# EAGLE schematic kreme-iss (EAGLE 9.5.1)

## Sheet 1 of 4
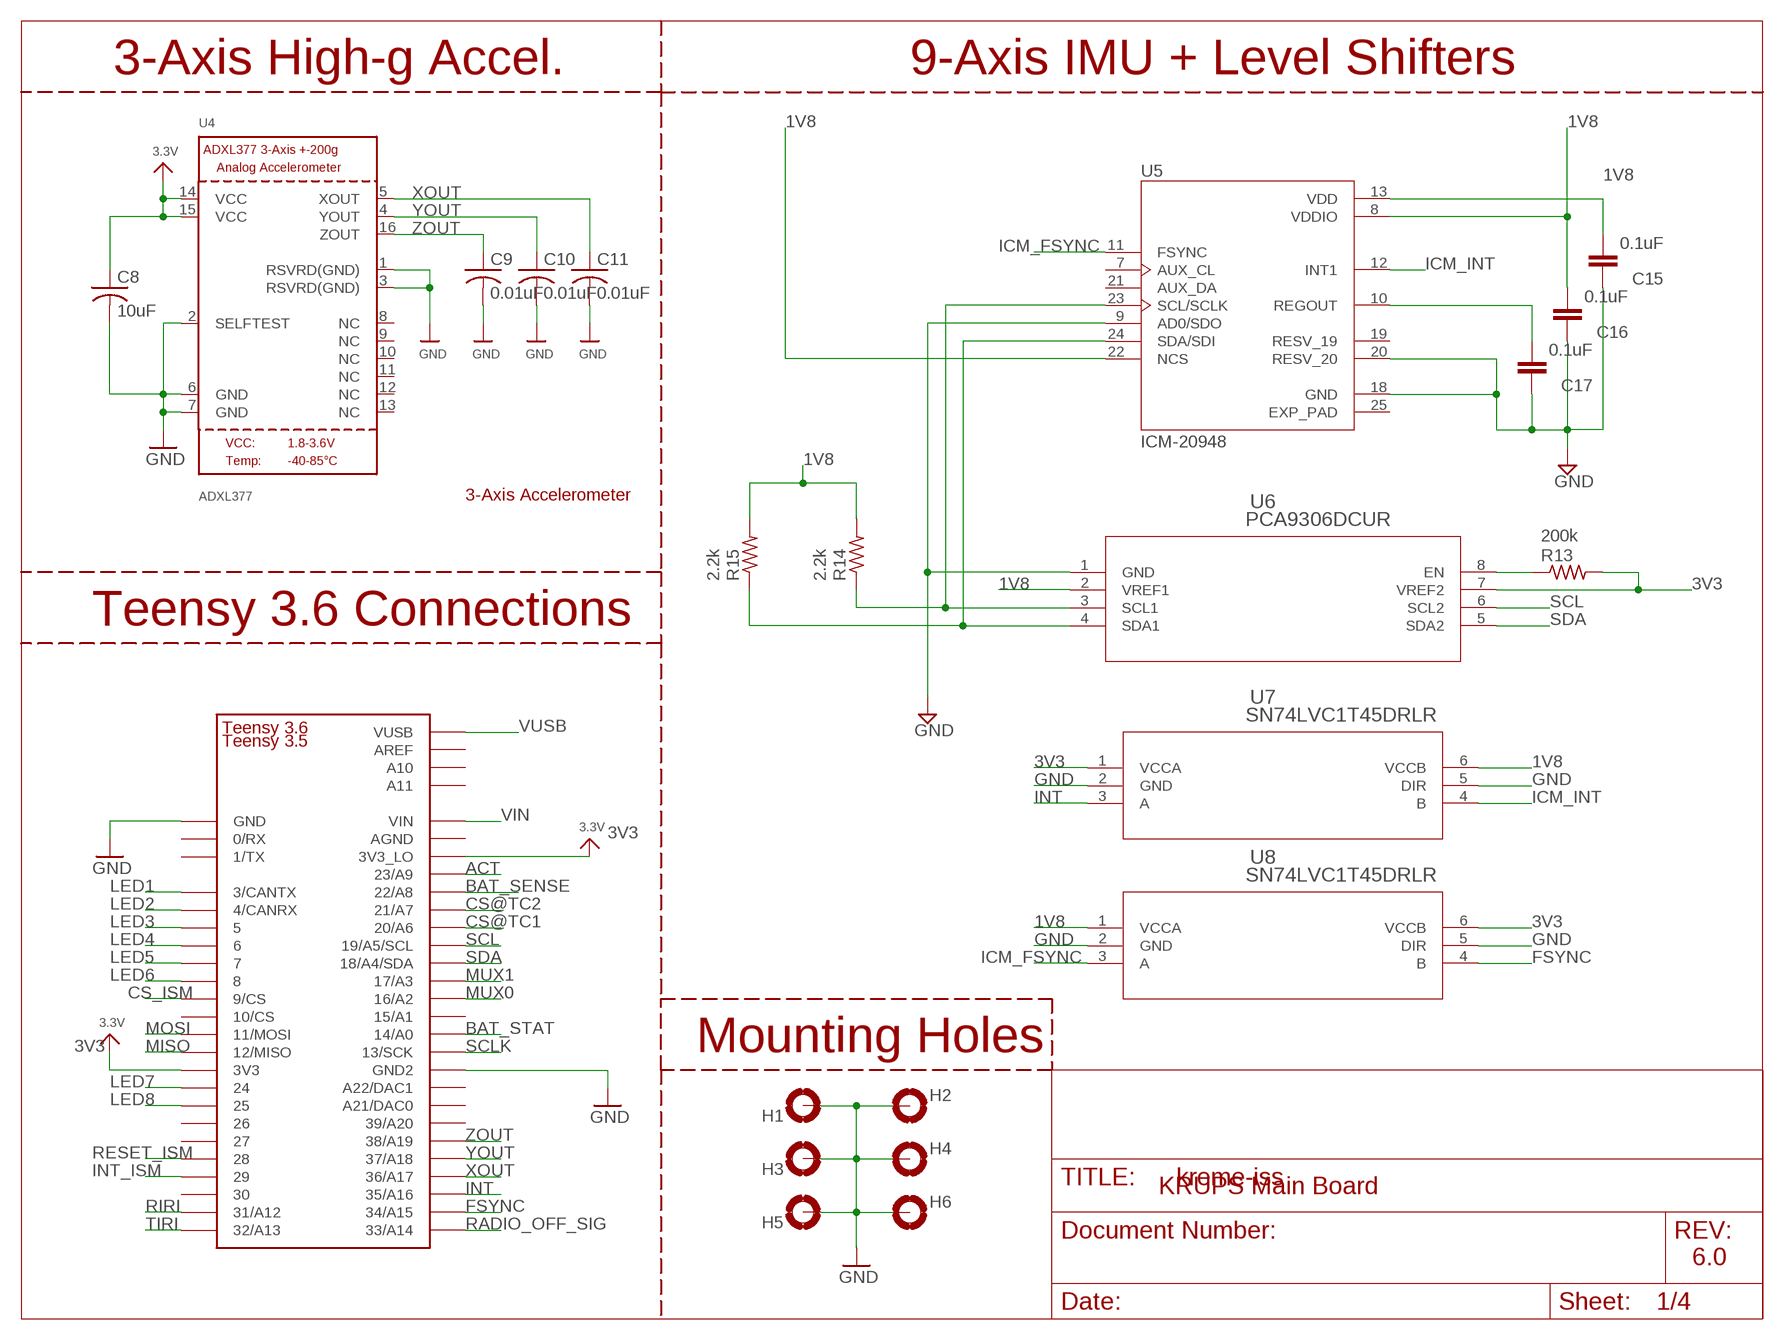
[diagram p0: schematic, sheet 1]

### Parts
C8  10uF  C-USC0603  [C0603]
C9  0.01uF  C-USC0603  [C0603]
C10  0.01uF  C-USC0603  [C0603]
C11  0.01uF  C-USC0603  [C0603]
C15  0.1uF  C-EUC0603  [C0603]
C16  0.1uF  C-EUC0603  [C0603]
C17  0.1uF  C-EUC0603  [C0603]
H1  MOUNT-PAD-ROUND2.8  [2,8-PAD]
H2  MOUNT-PAD-ROUND2.8  [2,8-PAD]
H3  MOUNT-PAD-ROUND2.8  [2,8-PAD]
H4  MOUNT-PAD-ROUND2.8  [2,8-PAD]
H5  MOUNT-PAD-ROUND2.8  [2,8-PAD]
H6  MOUNT-PAD-ROUND2.8  [2,8-PAD]
R13  200k  R-US_R0603  [R0603]
R14  2.2k  R-US_R0603  [R0603]
R15  2.2k  R-US_R0603  [R0603]
U4  ADXL377  ACCEL_ADXL377  [LFCSP16_LQ]
U5  ICM-20948  [QFN40P300X300X105-25N]
U6  PCA9306DCUR  [DCU8]
U7  SN74LVC1T45DRLR  [DRL6]
U8  SN74LVC1T45DRLR  [DRL6]
U$1  TEENSY_3.5/3.6_BASIC  [TEENSY_3.5/3.6_BASIC]

### Nets
1V8: C15.2 C16.2 R14.2 R15.2 U5.8(VDDIO) U5.13(VDD) U5.22(NCS) U6.2(VREF1) U7.6(VCCB) U8.1(VCCA) ; also sheet 3
3V3: C8.1 R13.2 U4.14(VCC) U4.15(VCC) U6.7(VREF2) U7.1(VCCA) U8.6(VCCB) U$1.3V3 U$1.3V3_LO ; supply symbol labelled 3.3V ; also sheet 2,3
ACT: U$1.23/A9 ; also sheet 3
BAT_SENSE: U$1.22/A8 ; also sheet 3
BAT_STAT: U$1.14/A0 ; also sheet 3
CS@TC1: U$1.20/A6 ; also sheet 2
CS@TC2: U$1.21/A7 ; also sheet 2
CS_ISM: U$1.9/CS ; also sheet 4
FSYNC: U8.4(B) U$1.34/A15
GND: C8.2 C9.2 C10.2 C11.2 C15.1 C16.1 C17.1 H1.B2,8(MOUNT) H2.B2,8(MOUNT) H3.B2,8(MOUNT) H4.B2,8(MOUNT) H5.B2,8(MOUNT) H6.B2,8(MOUNT) U4.1(RSVRD(GND)) U4.2(SELFTEST) U4.3(RSVRD(GND)) U4.6(GND) U4.7(GND) U5.9(AD0/SDO) U5.18(GND) U5.20(RESV_20) U6.1(GND) U7.2(GND) U7.5(DIR) U8.2(GND) U8.5(DIR) U$1.GND ; also sheet 2,3,4
ICM_FSYNC: U5.11(FSYNC) U8.3(A)
ICM_INT: U5.12(INT1) U7.4(B)
INT: U7.3(A) U$1.35/A16
INT_ISM: U$1.29 ; also sheet 4
LED1: U$1.3/CANTX ; also sheet 4
LED2: U$1.4/CANRX ; also sheet 4
LED3: U$1.5 ; also sheet 4
LED4: U$1.6 ; also sheet 4
LED5: U$1.7 ; also sheet 4
LED6: U$1.8 ; also sheet 4
LED7: U$1.24 ; also sheet 4
LED8: U$1.25 ; also sheet 4
MISO: U$1.12/MISO ; also sheet 2,4
MOSI: U$1.11/MOSI ; also sheet 4
MUX0: U$1.16/A2 ; also sheet 2
MUX1: U$1.17/A3 ; also sheet 2
N$1: U$1.GND2 ; supply symbol labelled GND
N$13: R13.1 U6.8(EN)
N$15: C17.2 U5.10(REGOUT)
N$18: R14.1 U5.23(SCL/SCLK) U6.3(SCL1)
N$19: R15.1 U5.24(SDA/SDI) U6.4(SDA1)
RADIO_OFF_SIG: U$1.33/A14 ; also sheet 3
RESET_ISM: U$1.28 ; also sheet 4
RIRI: U$1.31/A12 ; also sheet 2
SCL: U6.6(SCL2) U$1.19/A5/SCL
SCLK: U$1.13/SCK ; also sheet 2,4
SDA: U6.5(SDA2) U$1.18/A4/SDA
TIRI: U$1.32/A13 ; also sheet 2
VIN: U$1.VIN ; also sheet 3
VUSB: U$1.VUSB ; also sheet 3
XOUT: C11.1 U4.5(XOUT) U$1.36/A17
YOUT: C10.1 U4.4(YOUT) U$1.37/A18
ZOUT: C9.1 U4.16(ZOUT) U$1.38/A19
Unconnected: U4.8(NC) U4.9(NC) U4.10(NC) U4.11(NC) U4.12(NC) U4.13(NC) U5.7(AUX_CL) U5.19(RESV_19) U5.21(AUX_DA) U$1.0/RX U$1.1/TX U$1.10/CS U$1.15/A1 U$1.21/DAC0(A21/DAC0) U$1.26 U$1.27 U$1.30 U$1.39/A20 U$1.A10 U$1.A11 U$1.A22/DAC1 U$1.AGND U$1.AREF

### Notes on the sheet
- 3-Axis High-g Accel. | 9-Axis IMU + Level Shifters
- 3-Axis Accelerometer
- Teensy 3.6 Connections
- Teensy 3.5
- Mounting Holes
- KRUPS Main Board
- 6.0

## Sheet 2 of 4
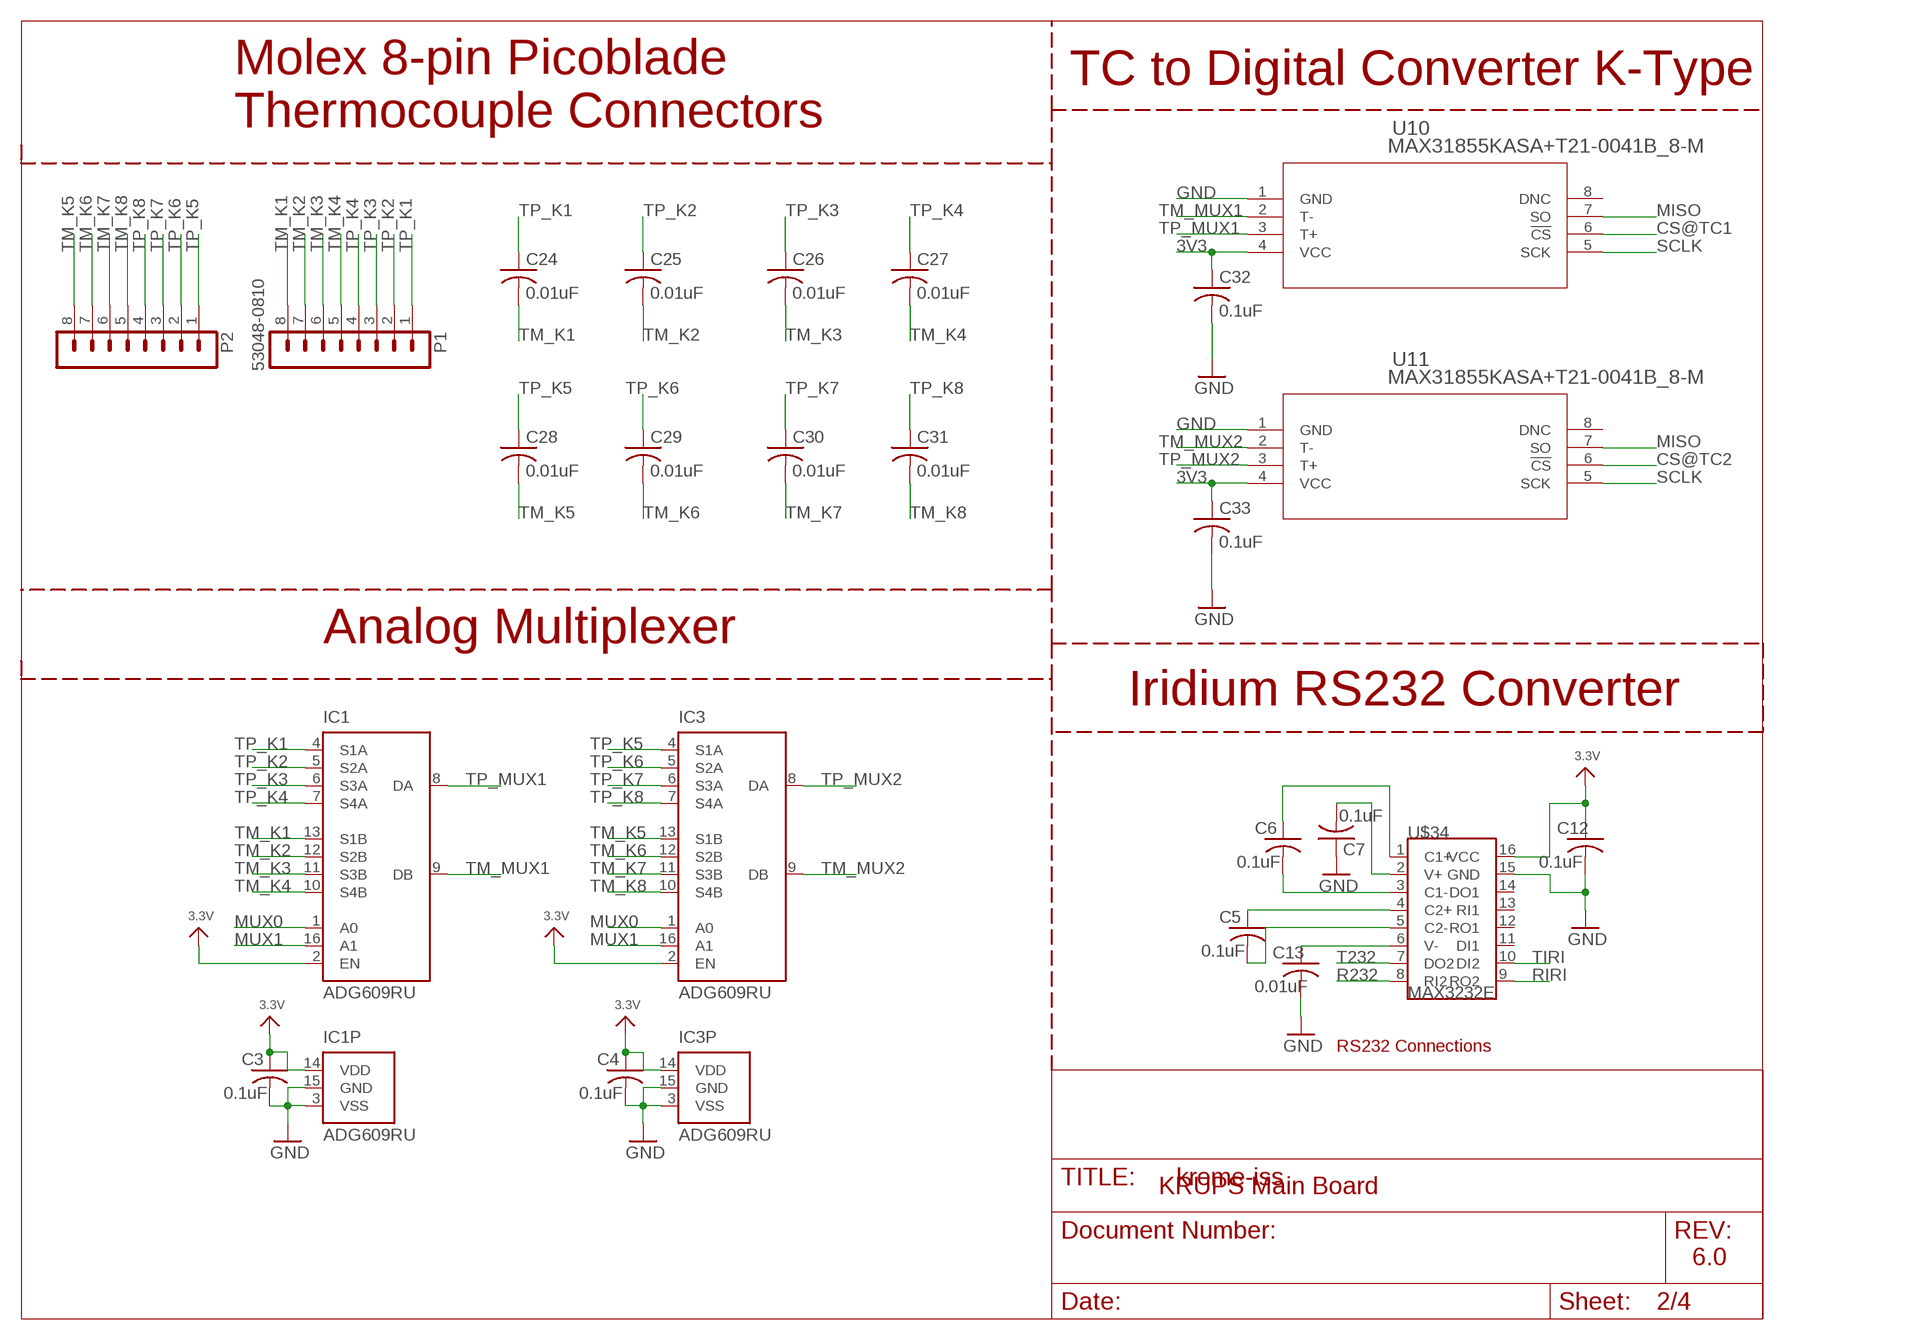
[diagram p1: schematic, sheet 2]

### Parts
C3  0.1uF  C-USC0603  [C0603]
C4  0.1uF  C-USC0603  [C0603]
C5  0.1uF  C-USC0603  [C0603]
C6  0.1uF  C-USC0603  [C0603]
C7  0.1uF  C-USC0603  [C0603]
C12  0.1uF  C-USC0603  [C0603]
C13  0.01uF  C-USC0603  [C0603]
C24  0.01uF  C-USC0603  [C0603]
C25  0.01uF  C-USC0603  [C0603]
C26  0.01uF  C-USC0603  [C0603]
C27  0.01uF  C-USC0603  [C0603]
C28  0.01uF  C-USC0603  [C0603]
C29  0.01uF  C-USC0603  [C0603]
C30  0.01uF  C-USC0603  [C0603]
C31  0.01uF  C-USC0603  [C0603]
C32  0.1uF  C-USC0603  [C0603]
C33  0.1uF  C-USC0603  [C0603]
IC1  ADG609RU  [TSSOP16]
IC3  ADG609RU  [TSSOP16]
P1  53048-0810  [53048-0810]
P2  53048-0810  [53048-0810]
U10  MAX31855KASA+T21-0041B_8-M  [21-0041B_8-M]
U11  MAX31855KASA+T21-0041B_8-M  [21-0041B_8-M]
U$34  MAX3232E  [SSOP-16]

### Nets
3V3: C3.1 C4.1 C12.1 C32.1 C33.1 IC1.2(EN) IC1.14(VDD) IC3.2(EN) IC3.14(VDD) U10.4(VCC) U11.4(VCC) U$34.16(VCC) ; supply symbol labelled 3.3V ; also sheet 1,3
CS@TC1: U10.6(!CS) ; also sheet 1
CS@TC2: U11.6(!CS) ; also sheet 1
GND: C3.2 C4.2 C7.1 C12.2 C13.2 C32.2 C33.2 IC1.3(VSS) IC1.15(GND) IC3.3(VSS) IC3.15(GND) U10.1(GND) U11.1(GND) U$34.15(GND) ; also sheet 1,3,4
MISO: U10.7(SO) U11.7(SO) ; also sheet 1,4
MUX0: IC1.1(A0) IC3.1(A0) ; also sheet 1
MUX1: IC1.16(A1) IC3.16(A1) ; also sheet 1
N$5: C5.2 U$34.5(C2-)
N$8: C6.1 U$34.1(C1+)
N$10: C6.2 U$34.3(C1-)
N$11: C5.1 U$34.4(C2+)
N$14: C13.1 U$34.6(V-)
N$17: C7.2 U$34.2(V+)
R232: U$34.8(RI2) ; also sheet 3
RIRI: U$34.9(RO2) ; also sheet 1
SCLK: U10.5(SCK) U11.5(SCK) ; also sheet 1,4
T232: U$34.7(DO2) ; also sheet 3
TIRI: U$34.10(DI2) ; also sheet 1
TM_K1: C24.2 IC1.13(S1B) P1.8
TM_K2: C25.2 IC1.12(S2B) P1.7
TM_K3: C26.2 IC1.11(S3B) P1.6
TM_K4: C27.2 IC1.10(S4B) P1.5
TM_K5: C28.2 IC3.13(S1B) P2.8
TM_K6: C29.2 IC3.12(S2B) P2.7
TM_K7: C30.2 IC3.11(S3B) P2.6
TM_K8: C31.2 IC3.10(S4B) P2.5
TM_MUX1: IC1.9(DB) U10.2(T-)
TM_MUX2: IC3.9(DB) U11.2(T-)
TP_K1: C24.1 IC1.4(S1A) P1.1
TP_K2: C25.1 IC1.5(S2A) P1.2
TP_K3: C26.1 IC1.6(S3A) P1.3
TP_K4: C27.1 IC1.7(S4A) P1.4
TP_K5: C28.1 IC3.4(S1A) P2.1
TP_K6: C29.1 IC3.5(S2A) P2.2
TP_K7: C30.1 IC3.6(S3A) P2.3
TP_K8: C31.1 IC3.7(S4A) P2.4
TP_MUX1: IC1.8(DA) U10.3(T+)
TP_MUX2: IC3.8(DA) U11.3(T+)
Unconnected: U10.8(DNC) U11.8(DNC) U$34.11(DI1) U$34.12(RO1) U$34.13(RI1) U$34.14(DO1)

### Notes on the sheet
- TC to Digital Converter K-Type
- Molex 8-pin Picoblade
  Thermocouple Connectors
- Analog Multiplexer
- Iridium RS232 Converter
- RS232 Connections
- KRUPS Main Board
- 6.0

## Sheet 3 of 4
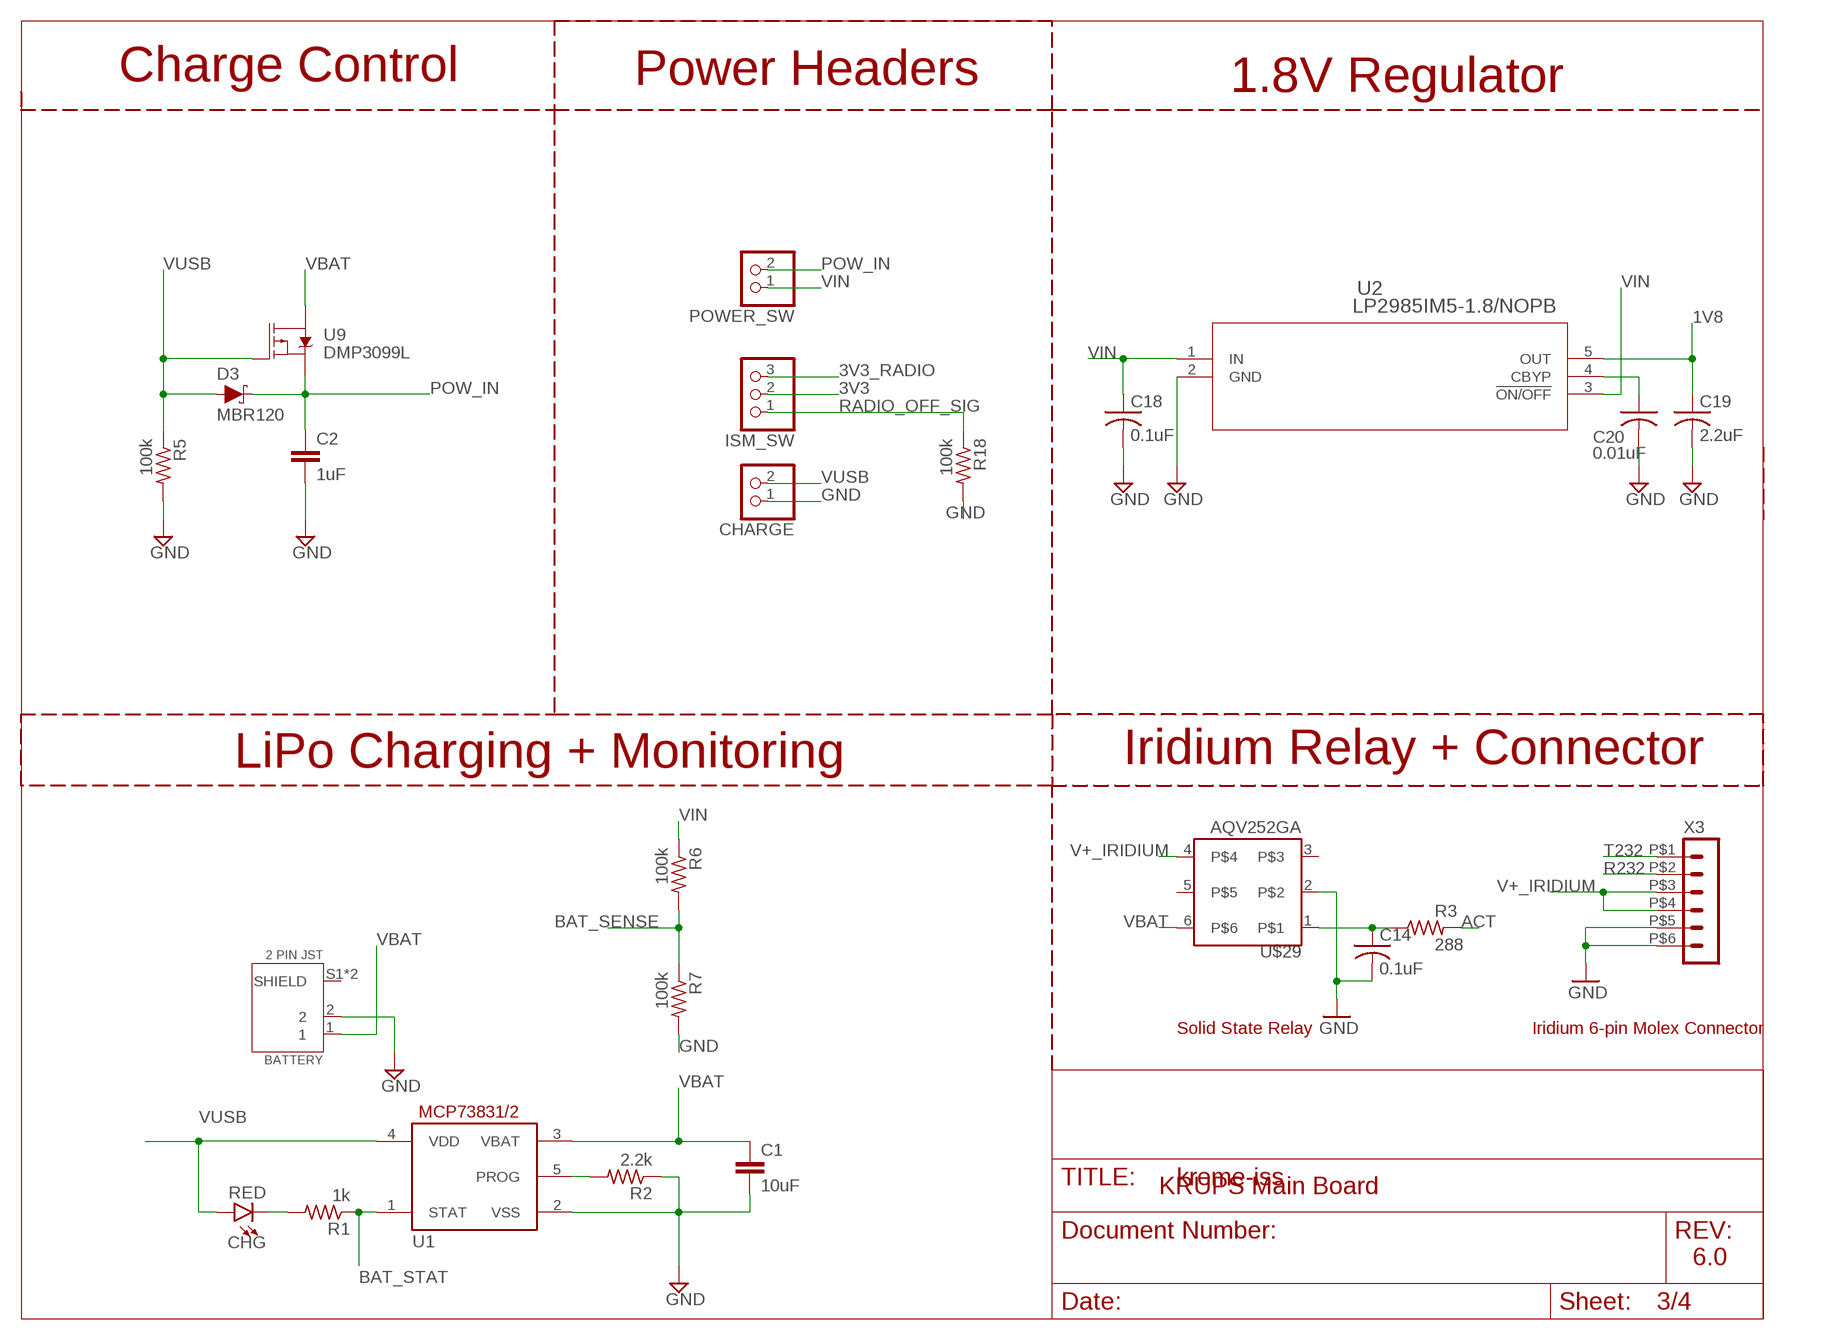
[diagram p2: schematic, sheet 3]

### Parts
BATTERY  2 PIN JST  S2B-PH-SM4-TB(LF)(SN)  [JST_S2B-PH-SM4-TB(LF)(SN)]
C1  10uF  C-EUC0603  [C0603]
C2  1uF  C-EUC0603  [C0603]
C14  0.1uF  C-USC0603  [C0603]
C18  0.1uF  C-USC0603  [C0603]
C19  2.2uF  C-USC0603  [C0603]
C20  0.01uF  C-USC0603  [C0603]
CHARGE  PINHD-1X2  [1X02]
CHG  RED  LED-RED0603  [LED-0603]
D3  MBR120  [SOD123FL]
ISM_SW  PINHD-1X3CB  [1X03-CLEANBIG]
POWER_SW  PINHD-1X2  [1X02]
R1  1k  R-US_R0603  [R0603]
R2  2.2k  R-US_R0603  [R0603]
R3  288  R-US_R0603  [R0603]
R5  100k  R-US_R0603  [R0603]
R6  100k  R-US_R0603  [R0603]
R7  100k  R-US_R0603  [R0603]
R18  100k  R-US_R0603  [R0603]
U1  MCP73831/OT  [SOT23-5L]
U2  LP2985IM5-1.8/NOPB  [MF05A]
U9  DMP3099L  [SOT23]
U$29  AQV252GA  [DIP6]
X3  HEADER_POS6_43650-0600  [43650-0600]

### Nets
1V8: C19.1 U2.5(OUT) ; also sheet 1
3V3: ISM_SW.2 ; also sheet 1,2
3V3_RADIO: ISM_SW.3 ; also sheet 4
ACT: R3.2 ; also sheet 1
BAT_SENSE: R6.2 R7.1 ; also sheet 1
BAT_STAT: R1.1 U1.1(STAT) ; also sheet 1
GND: BATTERY.2 C1.2 C2.2 C14.2 C18.2 C19.2 C20.2 CHARGE.1 R2.1 R5.2 R7.2 R18.2 U1.2(VSS) U2.2(GND) U$29.2 X3.P$5 X3.P$6 ; also sheet 1,2,4
N$4: R2.2 U1.5(PROG)
N$6: C14.1 R3.1 U$29.1
N$9: CHG.C R1.2
N$12: C20.1 U2.4(CBYP)
POW_IN: C2.1 D3.C POWER_SW.2 U9.2(S)
R232: X3.P$2 ; also sheet 2
RADIO_OFF_SIG: ISM_SW.1 R18.1 ; also sheet 1
T232: X3.P$1 ; also sheet 2
V+_IRIDIUM: U$29.4 X3.P$3 X3.P$4
VBAT: BATTERY.1 C1.1 U1.3(VBAT) U9.3(D) U$29.6
VIN: C18.1 POWER_SW.1 R6.1 U2.1(IN) U2.3(!ON/OFF) ; also sheet 1
VUSB: CHARGE.2 CHG.A D3.A R5.1 U1.4(VDD) U9.1(G) ; also sheet 1
Unconnected: BATTERY.S1(SHIELD) BATTERY.S2(SHIELD) U$29.3 U$29.5

### Notes on the sheet
- Charge Control | Power Headers | 1.8V Regulator
- LiPo Charging + Monitoring | Iridium Relay + Connector
- Solid State Relay | Iridium 6-pin Molex Connector
- KRUPS Main Board
- 6.0

## Sheet 4 of 4
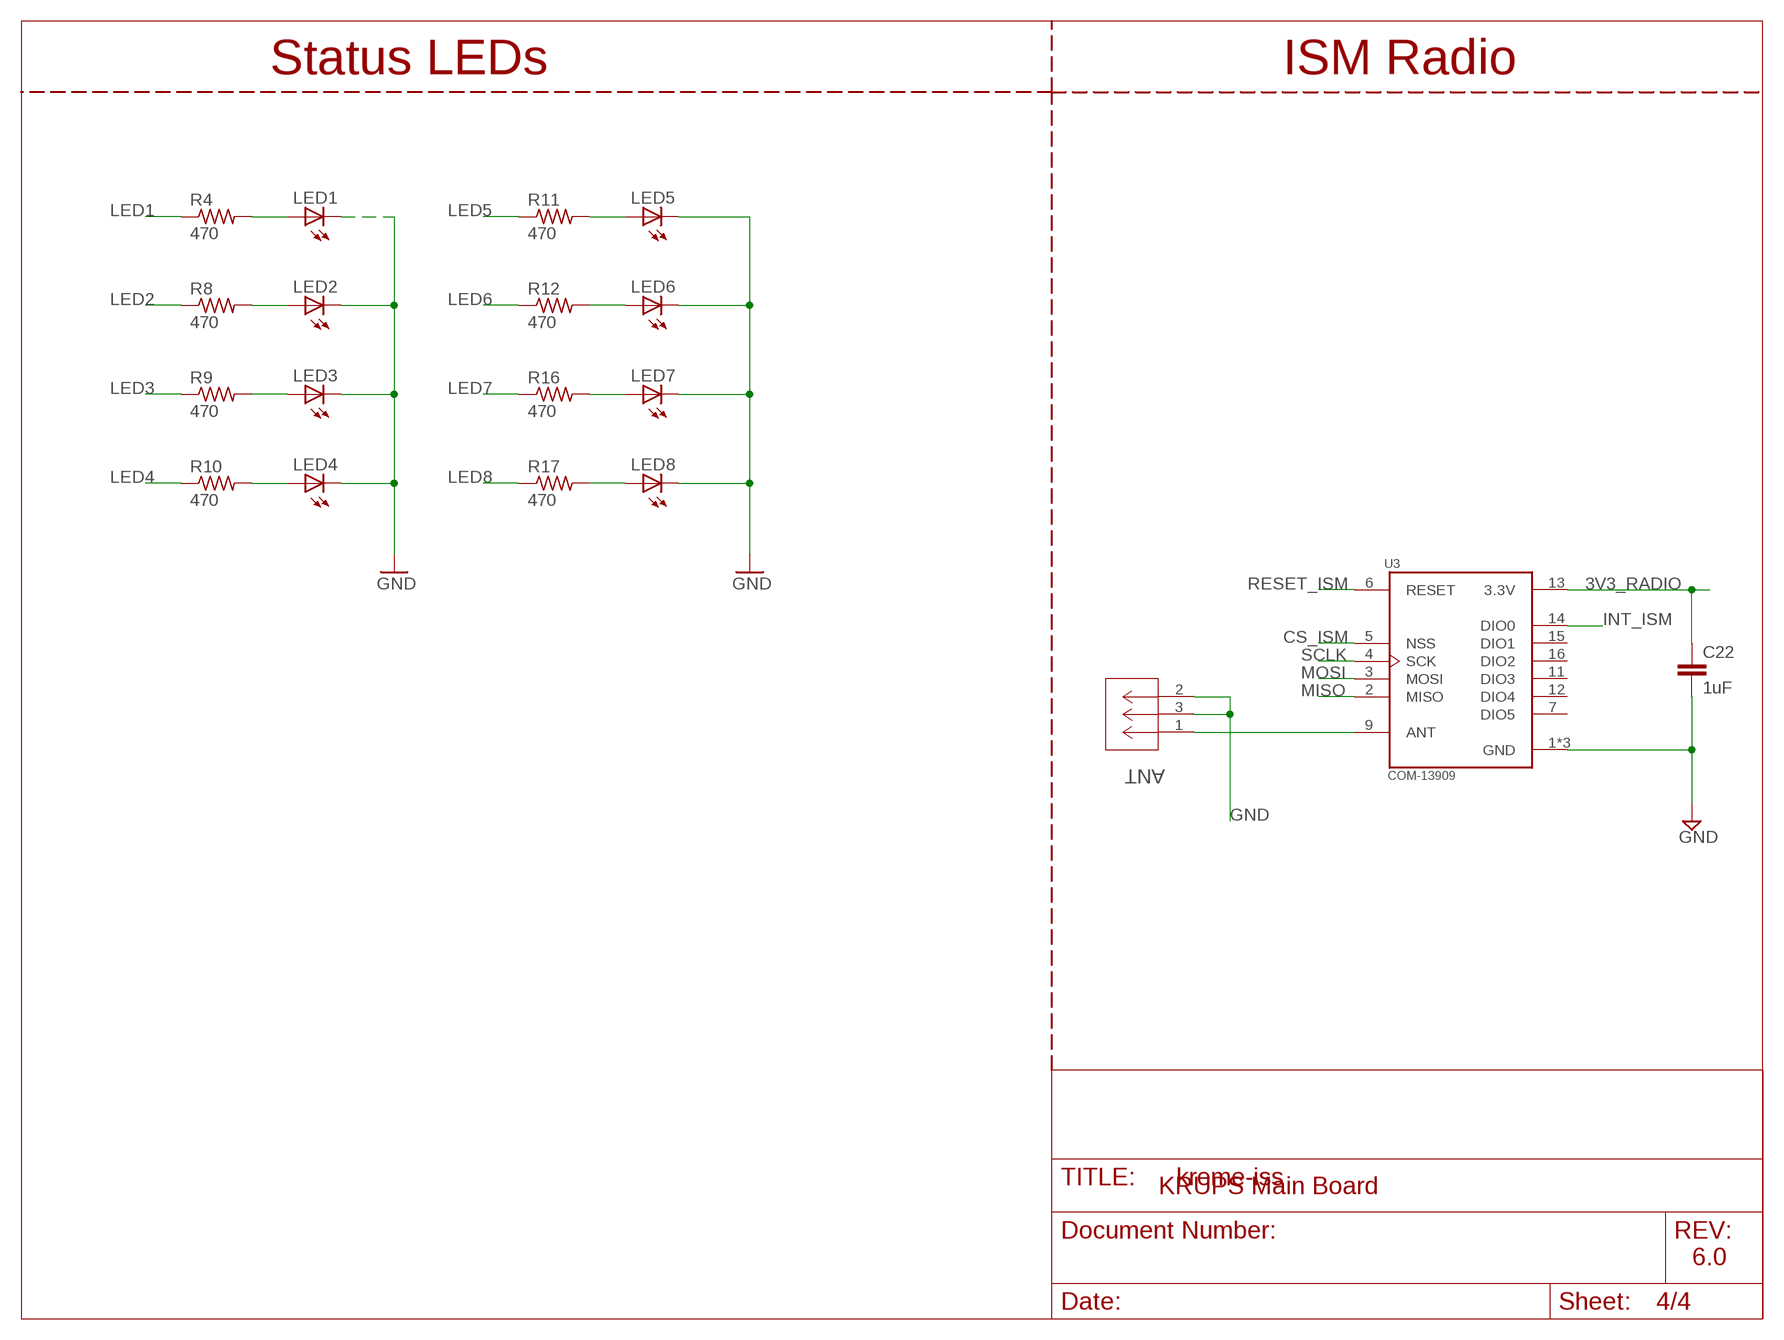
[diagram p3: schematic, sheet 4]

### Parts
ANT  U.FL-R-SMT-1(10)  [CONN_R-SMT-1(10)]
C22  1uF  C-EUC0603  [C0603]
LED1  LEDCHIP-LED0603  [CHIP-LED0603]
LED2  LEDCHIP-LED0603  [CHIP-LED0603]
LED3  LEDCHIP-LED0603  [CHIP-LED0603]
LED4  LEDCHIP-LED0603  [CHIP-LED0603]
LED5  LEDCHIP-LED0603  [CHIP-LED0603]
LED6  LEDCHIP-LED0603  [CHIP-LED0603]
LED7  LEDCHIP-LED0603  [CHIP-LED0603]
LED8  LEDCHIP-LED0603  [CHIP-LED0603]
R4  470  R-US_R0603  [R0603]
R8  470  R-US_R0603  [R0603]
R9  470  R-US_R0603  [R0603]
R10  470  R-US_R0603  [R0603]
R11  470  R-US_R0603  [R0603]
R12  470  R-US_R0603  [R0603]
R16  470  R-US_R0603  [R0603]
R17  470  R-US_R0603  [R0603]
U3  COM-13909  [MOD_COM-13909]

### Nets
3V3_RADIO: C22.1 U3.13(3.3V) ; also sheet 3
CS_ISM: U3.5(NSS) ; also sheet 1
GND: ANT.2 ANT.3 C22.2 LED1.C LED2.C LED3.C LED4.C LED5.C LED6.C LED7.C LED8.C U3.1(GND) U3.8(GND) U3.10(GND) ; also sheet 1,2,3
INT_ISM: U3.14(DIO0) ; also sheet 1
LED1: R4.1 ; also sheet 1
LED2: R8.1 ; also sheet 1
LED3: R9.1 ; also sheet 1
LED4: R10.1 ; also sheet 1
LED5: R11.1 ; also sheet 1
LED6: R12.1 ; also sheet 1
LED7: R16.1 ; also sheet 1
LED8: R17.1 ; also sheet 1
MISO: U3.2(MISO) ; also sheet 1,2
MOSI: U3.3(MOSI) ; also sheet 1
N$3: ANT.1 U3.9(ANT)
N$20: LED1.A R4.2
N$21: LED2.A R8.2
N$22: LED3.A R9.2
N$23: LED4.A R10.2
N$28: LED5.A R11.2
N$29: LED6.A R12.2
N$30: LED7.A R16.2
N$31: LED8.A R17.2
RESET_ISM: U3.6(RESET) ; also sheet 1
SCLK: U3.4(SCK) ; also sheet 1,2
Unconnected: U3.7(DIO5) U3.11(DIO3) U3.12(DIO4) U3.15(DIO1) U3.16(DIO2)

### Notes on the sheet
- Status LEDs | ISM Radio
- KRUPS Main Board
- 6.0

## Power pins joined to a net without a drawn wire
EXP_PAD: U5.25(EXP_PAD)

## Library data of the parts
ANT = ufl:U.FL-R-SMT-1(10); BUILT_BY: EMA_Matt; COPYRIGHT: Copyright (C) 2018 Accelerated Designs. All rights reserved; MANUFACTURER_PART_NUMBER: U.FL-R-SMT-1(10); VENDOR: Hirose
BATTERY = S2B-PH-SM4-TB_LF__SN_:S2B-PH-SM4-TB(LF)(SN): PH Series 2 Position 2 mm Pitch Surface Mount Side Entry Shrouded Header; DESCRIPTION: PH Series 2 Position 2 mm Pitch Surface Mount Side Entry Shrouded Header; DIGI-KEY_PART_NUMBER: 455-1749-1-ND; DIGI-KEY_PURCHASE_URL: https://www.digikey.com/product-detail/en/jst-sales-america-inc/S2B-PH-SM4-TB_LF__SN_/455-1749-1-ND/926846?utm_source=snapeda&utm_medium=aggregator&utm_campaign=symbol; MF: JST Sales; MP: S2B-PH-SM4-TB_LF__SN_; PACKAGE: FakePackage u
C1 C2 C15-C17 C22 = rcl:C-EU: CAPACITOR, European symbol; SPICEPREFIX: C
C3-C14 C24-C33 = adafruit:C-US: CAPACITOR, American symbol
C18-C20 = rcl:C-US: CAPACITOR, American symbol; SPICEPREFIX: C
CHARGE POWER_SW = pinhead:PINHD-1X2: PIN HEADER
CHG = SparkFun-LED:LED-RED: Red SMD LED Used in manufacturing of most products at SparkFun Packages: 0603 - SMD 0603 package [Product Link] <http://docs.avagotech.com/docs/AV02-0551EN> 0603 SMART - SMD 0603 SMART package ( more efficient and expensive)[Product Link] <http://www.osram-os.com/Graphics/XPic2/00077099_0.pdf> 1206 - SMD1206 package [Product Link] <https://www.sparkfun.com/datasheets/DevTools/LilyPad/Q150OVS4.pdff> SparkFun Products: Pro Mini 328 -5V <https://www.sparkfun.com/products/821> RedBoard <https://www.sparkfun.com/products/12757> IOIO-OTG <https://www.sparkfun.com/products/13613>; PROD_ID: DIO-00819
D3 = gsynth:MBR120: Diode Schottky 20V 1A Surface Mount SOD-123FL
H1-H6 = holes:MOUNT-PAD-ROUND: MOUNTING PAD, round
IC1 IC3 = analog-devices:ADG609: 3 V/5 V, 4 Channel High Performance Analog Multiplexers Source: ADG608_609.pdf; MPN: ADG609BRUZ; OC_FARNELL: 1438945; OC_NEWARK: 19M8664
ISM_SW = adafruit:PINHD-1X3: PIN HEADER
LED1-LED8 = adafruit:LED: LED OSRAM: - CHIPLED LG R971, LG N971, LY N971, LG Q971, LY Q971, LO R971, LY R971 LH N974, LH R974 LS Q976, LO Q976, LY Q976 LO Q996 - Hyper CHIPLED LW Q18S LB Q993, LB Q99A, LB R99A - SideLED LS A670, LO A670, LY A670, LG A670, LP A670 LB A673, LV A673, LT A673, LW A673 LH A674 LY A675 LS A676, LA A676, LO A676, LY A676, LW A676 LS A679, LY A679, LG A679 - Hyper Micro SIDELED® LS Y876, LA Y876, LO Y876, LY Y876 LT Y87S - SmartLED LW L88C, LW L88S LB L89C, LB L89S, LG L890 LS L89K, LO L89K, LY L89K LS L896, LA L896, LO L896, LY L896 - TOPLED LS T670, LO T670, LY T670, LG T670, LP T670 LSG T670, LSP T670, LSY T670, LOP T670, LYG T670 LG T671, LOG T671, LSG T671 LB T673, LV T673, LT T673, LW T673 LH T674 LS T676, LA T676, LO T676, LY T676, LB T676, LH T676, LSB T676, LW T676 LB T67C, LV T67C, LT T67C, LS T67K, LO T67K, LY T67K, LW E67C LS E67B, LA E67B, LO E67B, LY E67B, LB E67C, LV E67C, LT E67C LW T67C LS T679, LY T679, LG T679 LS T770, LO T770, LY T770, LG T770, LP T770 LB T773, LV T773, LT T773, LW T773 LH T774 LS E675, LA E675, LY E675, LS T675 LS T776, LA T776, LO T776, LY T776, LB T776 LHGB T686 LT T68C, LB T68C - Hyper Mini TOPLED® LB M676 - Mini TOPLED Santana® LG M470 LS M47K, LO M47K, LY M47K Source: http://www.osram.convergy.de/
P1 P2 = con-molex-picoblade:53048-0810: HEADER
R1 R2 R4-R18 = rcl:R-US_: RESISTOR, American symbol; SPICEPREFIX: R
R3 = adafruit:R-US_: RESISTOR, American symbol
U1 = adafruit:MCP73831: MCP73831/2 Miniature Single-Cell, Fully Integrated Li-Ion, Li-Polymer Charge Management Controllers. Nice and small simple lipoly charge controller, with adjustable current and status output (LED) http://www.ladyada.net/library/pcb/eaglelibrary.html
U2 = gsynth:LP2985IM5-1.8/NOPB; MANUFACTURER_PART_NUMBER: LP2985IM51.8NOPB; VENDOR: Texas Instruments
U3 = COM-13909:COM-13909: Rfm69hcw Wireless Transceiver 91; DESCRIPTION: General ISM < 1GHz Transceiver Module 915MHz Surface Mount; DIGI-KEY_PART_NUMBER: 1568-1394-ND; DIGI-KEY_PURCHASE_URL: https://www.digikey.com/product-detail/en/sparkfun-electronics/COM-13909/1568-1394-ND/6023504?utm_source=snapeda&utm_medium=aggregator&utm_campaign=symbol; MF: SparkFun Electronics; MP: COM-13909; PACKAGE: Module SparkFun Electronics
U4 = microbuilder:ACCEL_ADXL377: ADXL377 +/-200g 3-Axis Analog Accelerometer VCC: 1.8-3.6V
U5 = ICM-20948:ICM-20948: Axis=3 Axis Gyro+3 Axis Accel+Compass. Pin For Pin With m; DESCRIPTION: 9 Axis=3 Axis Gyro+3 Axis Accel+Compass. Pin For Pin With m; DIGI-KEY_PART_NUMBER: 1428-1123-1-ND; DIGI-KEY_PURCHASE_URL: https://www.digikey.com/product-detail/en/tdk-invensense/ICM-20948/1428-1123-1-ND/7062698?utm_source=snapeda&utm_medium=aggregator&utm_campaign=symbol; MF: TDK InvenSense; MP: ICM-20948; PACKAGE: QFN-24 InvenSense
U6 = gsynth:PCA9306DCUR; MANUFACTURER_PART_NUMBER: PCA9306DCUR; VENDOR: Texas Instruments
U7 U8 = gsynth:SN74LVC1T45DRLR; MANUFACTURER_PART_NUMBER: SN74LVC1T45DRLR; VENDOR: Texas Instruments
U9 = gsynth:DMP3099L: P-Channel 30V 3.8A (Ta) 1.08W (Ta) Surface Mount SOT-23
U10 U11 = max31855:MAX31855KASA+T; BUILT_BY: EMA_UL_Team; MANUFACTURER_PART_NUMBER: MAX31855KASA+T; VENDOR: Maxim Integrated Products
U$1 = Teensy356:TEENSY_3.5/3.6_BASIC
U$29 = TI_radio:AQV252GA
U$34 = TI_radio:MAX3232E: MAX3232 RS232 converter for use in 3.3-5V logic
X3 = con-molex-micro-fit-3_0:HEADER_POS6_?: Molex - Micro-Fit 3.0 Series connector, 3.00mm (0.118") pitch header, 6 positions.